# EAGLE design AIRDC (EAGLE 9.1.3)
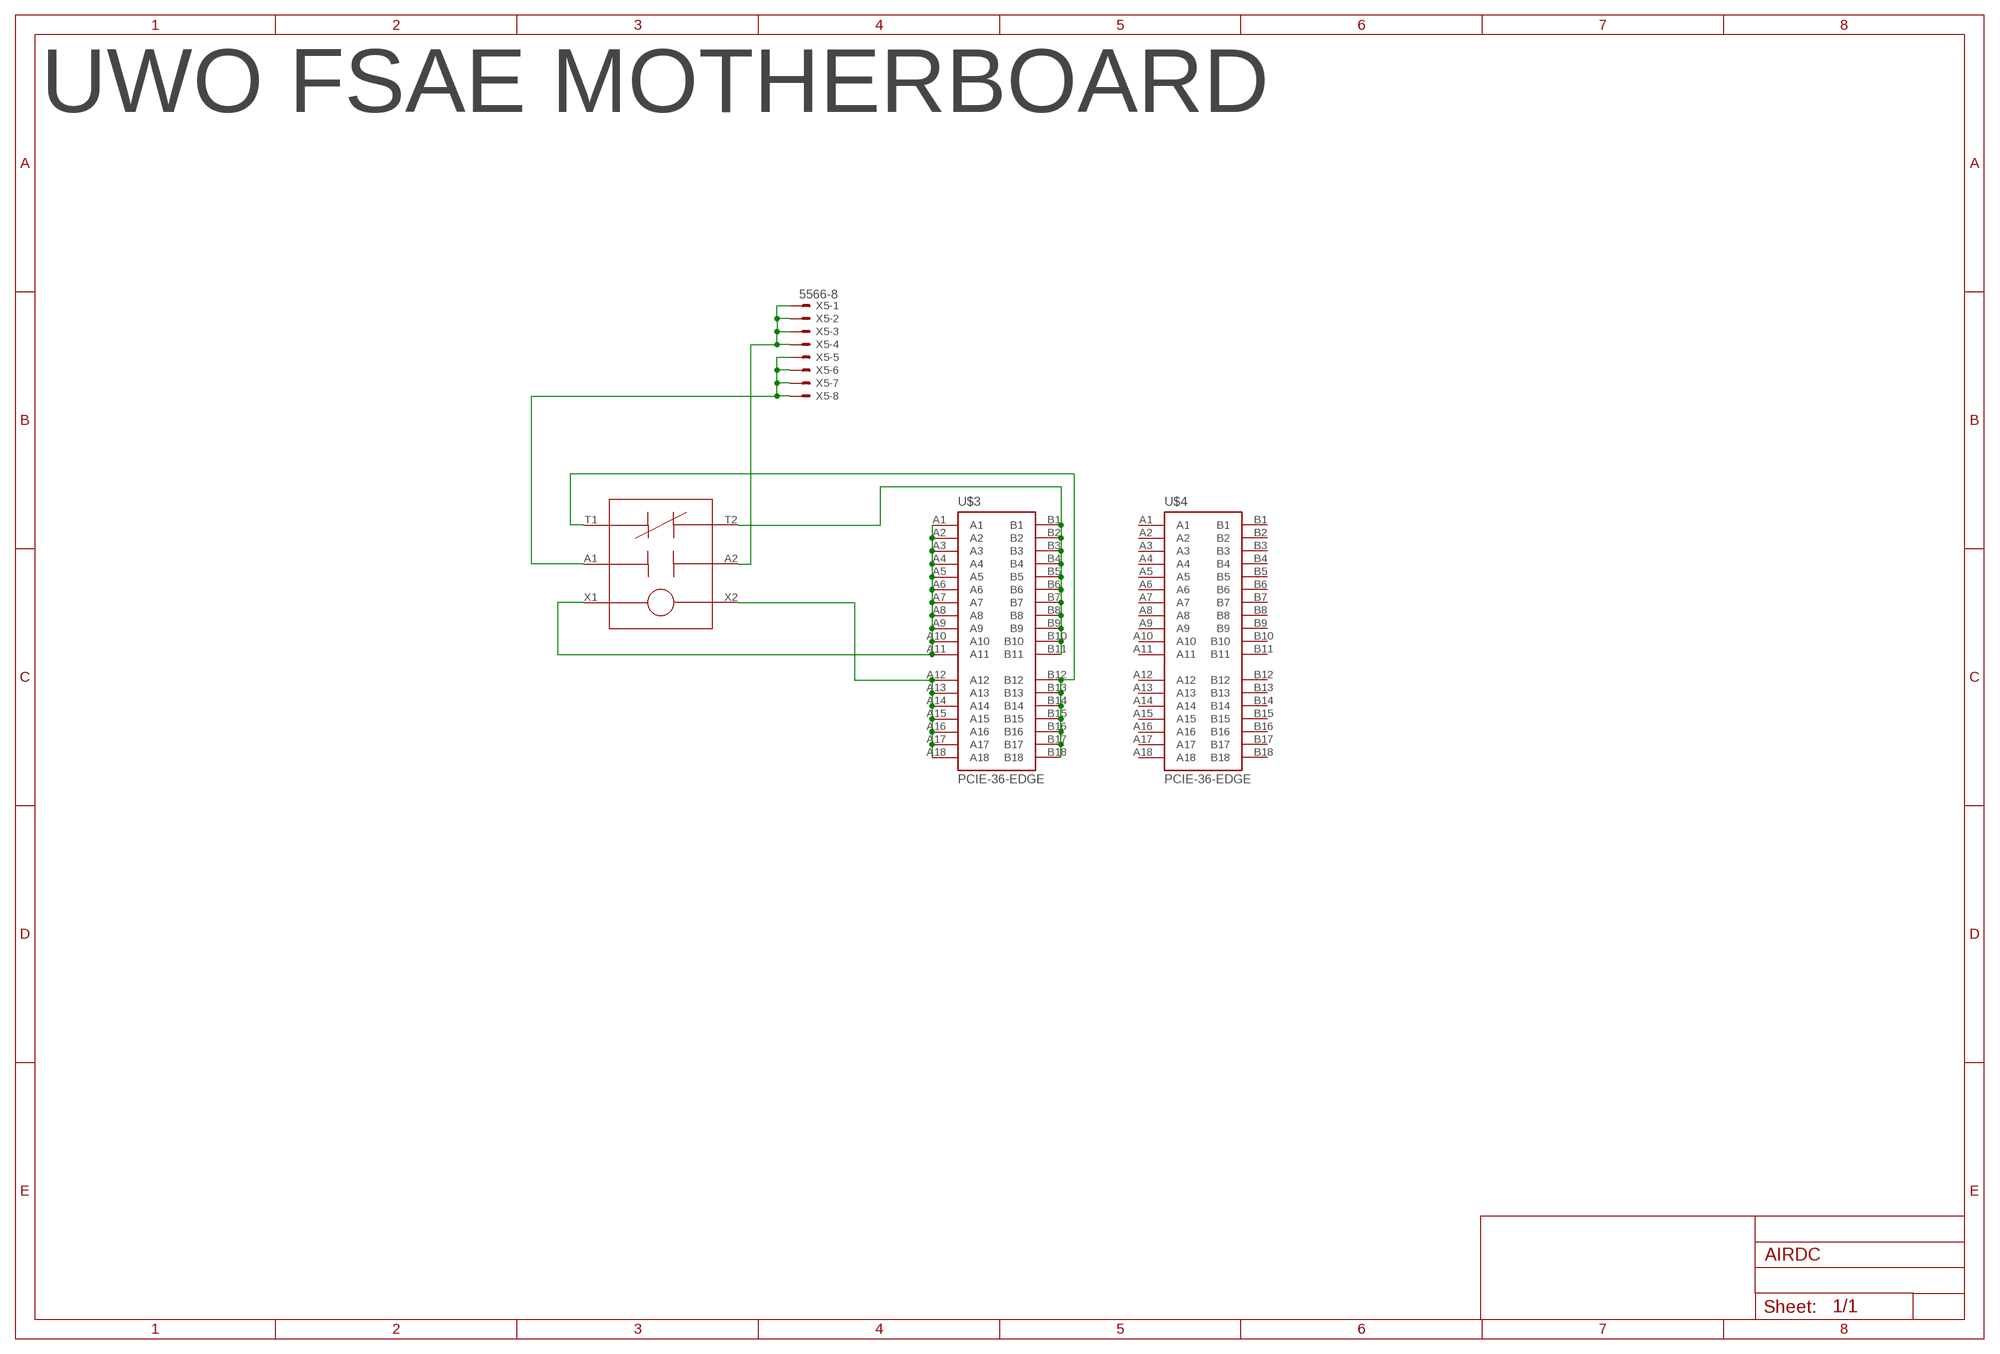
[diagram p0: schematic, sheet 1]

## Parts
U$1  GV224  [GV224]
U$3  PCIE-36-EDGE  [PCI-E_SLOT_36]
U$4  PCIE-36-EDGE  [PCI-E_SLOT_36]
X5  5566-8  [5566-8]

## Nets
N$1: U$1.T1 U$3.B12 U$3.B13 U$3.B14 U$3.B15 U$3.B16 U$3.B17 U$3.B18
N$2: U$1.X1 U$3.A1 U$3.A2 U$3.A3 U$3.A4 U$3.A5 U$3.A6 U$3.A7 U$3.A8 U$3.A9 U$3.A10 U$3.A11
N$3: U$1.X2 U$3.A12 U$3.A13 U$3.A14 U$3.A15 U$3.A16 U$3.A17 U$3.A18
N$5: U$1.A1 X5.5 X5.6 X5.7 X5.8
N$6: U$1.A2 X5.1 X5.2 X5.3 X5.4
N$7: U$1.T2 U$3.B1 U$3.B2 U$3.B3 U$3.B4 U$3.B5 U$3.B6 U$3.B7 U$3.B8 U$3.B9 U$3.B10 U$3.B11
Unconnected: U$4.A1 U$4.A2 U$4.A3 U$4.A4 U$4.A5 U$4.A6 U$4.A7 U$4.A8 U$4.A9 U$4.A10 U$4.A11 U$4.A12 U$4.A13 U$4.A14 U$4.A15 U$4.A16 U$4.A17 U$4.A18 U$4.B1 U$4.B2 U$4.B3 U$4.B4 U$4.B5 U$4.B6 U$4.B7 U$4.B8 U$4.B9 U$4.B10 U$4.B11 U$4.B12 U$4.B13 U$4.B14 U$4.B15 U$4.B16 U$4.B17 U$4.B18

## Notes on the sheet
- UWO FSAE MOTHERBOARD

## Library data of the parts
U$1 = ACC-MB-R0:GV224
U$3 U$4 = ACC-MB-R0:PCIE-36-EDGE
X5 = con-molex:5566-8: Mini FIT connector 8 pol Source: http://www.molex.com; MF: MOLEX; OC_FARNELL: unknown; OC_NEWARK: unknown

## Net classes
0 default: width 1 mm, clearance 0.152 mm
1 LV: clearance 0.001 mm

## Board
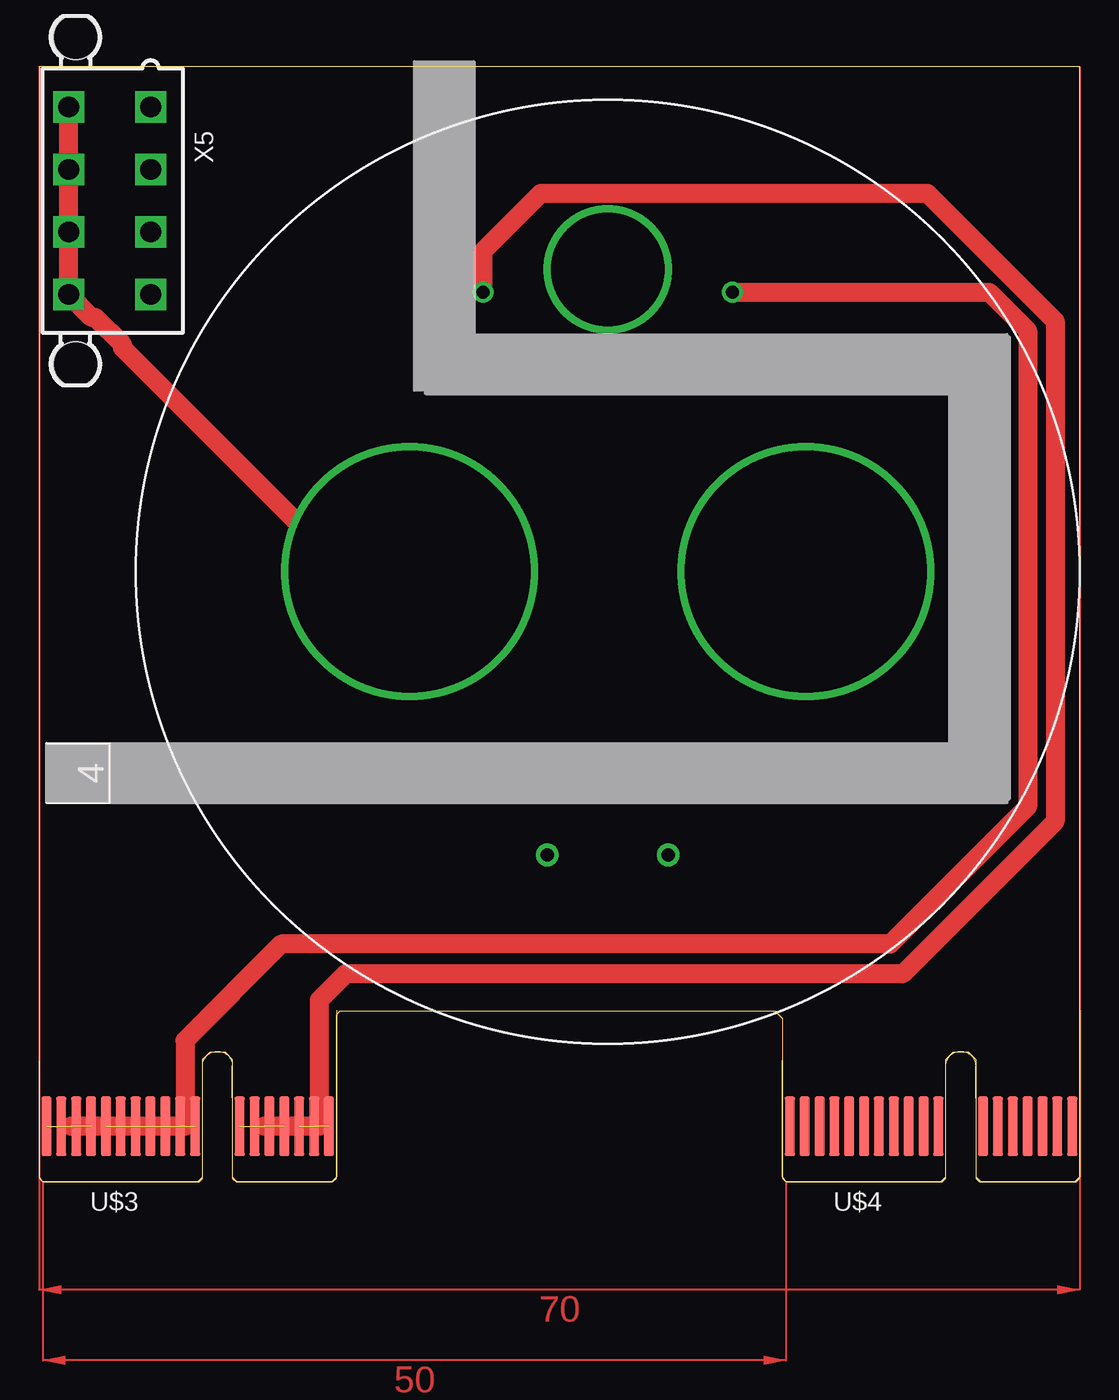
[diagram p1: board, top side]
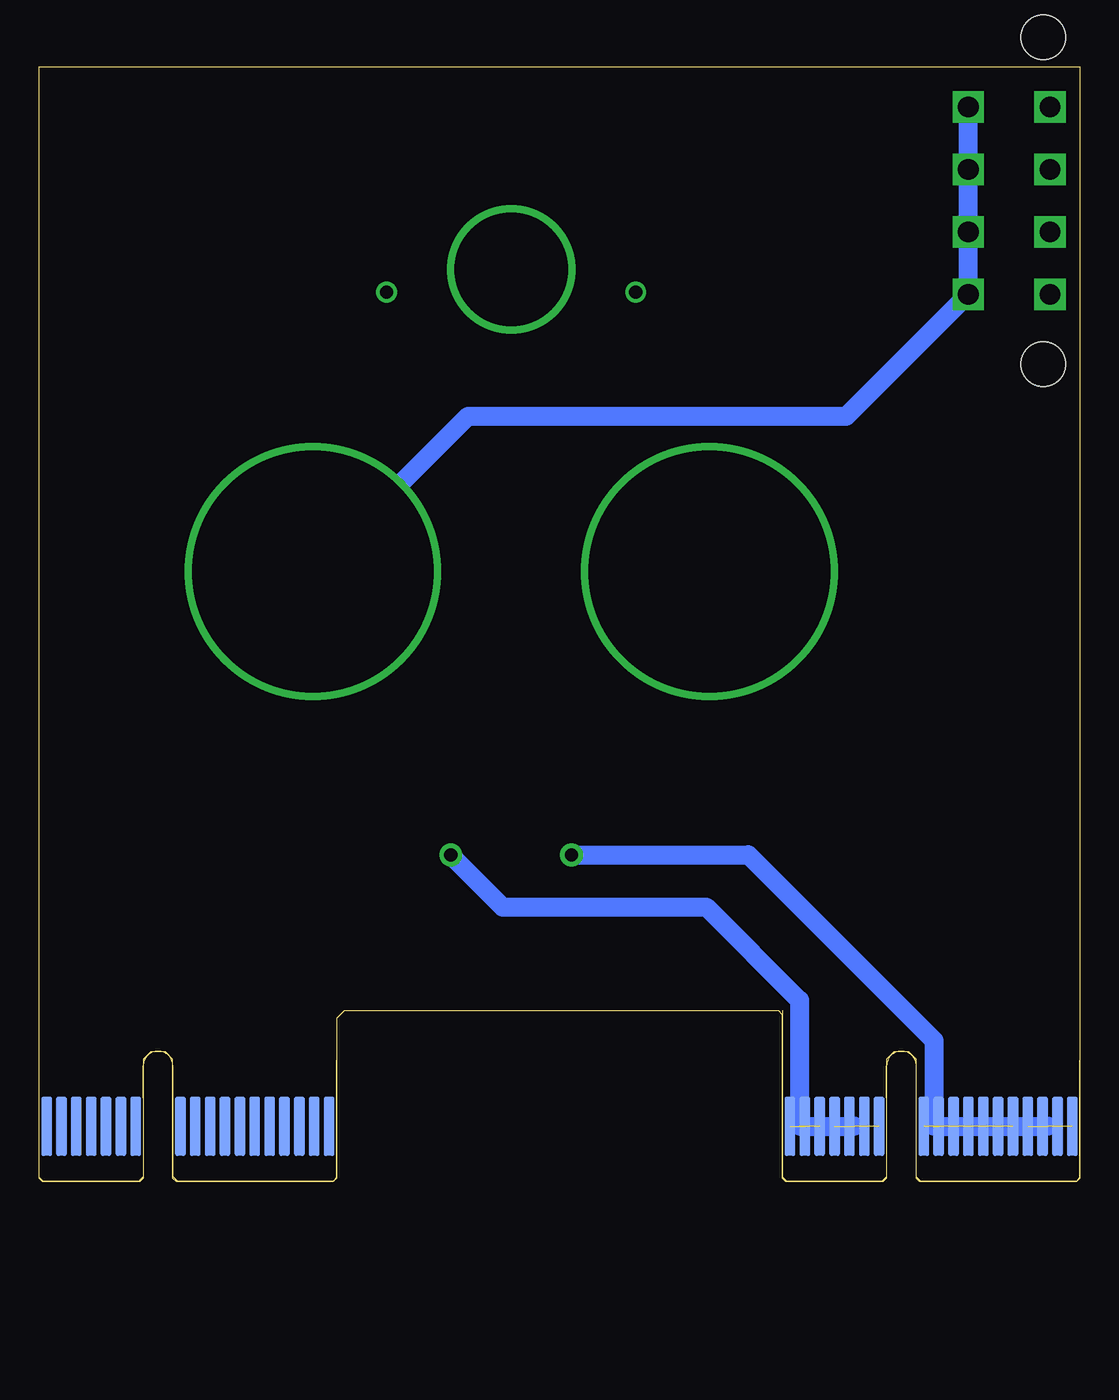
[diagram p2: board, bottom side, seen from below]

Size 70.02 x 75 mm. Coordinates in mm from the lower left corner, seen from the top.
Outline: 70,0.25 70,75 0.01,75 0.01,0.25 0.26,0 10.76,0 11.01,0.25 11.01,8.25 11.51,8.75 12.51,8.75 13.01,8.25 13.01,0.25 13.26,0 19.75,0 20,0.25 20,11.25 20.25,11.5 49.51,11.5 50.01,11 50.01,0.25 50.26,0 60.76,0 61.01,0.25 61.01,8.25 61.51,8.75 62.51,8.75 63.01,8.25 63.01,0.25 63.26,0 69.75,0 70,0.25
Copper layers (1*16): Top 0.035mm / dielectric 1.5mm / Bottom 0.035mm
Design rules "default": minimum track width 6mil, minimum drill 0.35mm, track to track 6mil, track to pad 6mil, pad to pad 6mil, via to via 6mil, smd to smd 6mil, copper to edge 40mil, drill to drill 6mil, minimum pad ring 10mil, minimum via ring 8mil, stop-mask expansion 4mil, vias tented up to drill 0mil, thermal gap 10mil

### Footprints (pad centres in the part's own frame; a part is rotated, then mirrored left to right if it is on the bottom)
GV224 = drill 16.256: A1 -13.335,19.05; A2 13.335,19.05 | drill 7.62: NC1 0,39.37 | drill 0.889: T1 -8.382,37.846; T2 8.382,37.846 | drill 0.889 pad 1.524: X1 -4.064,0; X2 4.064,0
PCI-E_SLOT_36 = smd 0.7 x 4 bottom: A1 0.245,3.75; A2 1.245,3.75; A3 2.245,3.75; A4 3.245,3.75; A5 4.245,3.75; A6 5.245,3.75; A7 6.245,3.75; A8 7.245,3.75; A9 8.245,3.75; A10 9.245,3.75; A11 10.245,3.75; A12 13.245,3.75; A13 14.245,3.75; A14 15.245,3.75; A15 16.245,3.75; A16 17.245,3.75; A17 18.245,3.75; A18 19.245,3.75 | smd 0.7 x 4: B1 0.245,3.75; B2 1.245,3.75; B3 2.245,3.75; B4 3.245,3.75; B5 4.245,3.75; B6 5.245,3.75; B7 6.245,3.75; B8 7.245,3.75; B9 8.245,3.75; B10 9.245,3.75; B11 10.245,3.75; B12 13.245,3.75; B13 14.245,3.75; B14 15.245,3.75; B15 16.245,3.75; B16 17.245,3.75; B17 18.245,3.75; B18 19.245,3.75
5566-8 = drill 1.4 square: 1 6.3,-2.75; 2 2.1,-2.75; 3 -2.1,-2.75; 4 -6.3,-2.75; 5 6.3,2.75; 6 2.1,2.75; 7 -2.1,2.75; 8 -6.3,2.75 | hole 3: 11,2.29; -11,2.29

### Placement (x,y rotation side)
U$1  38.26,22 0 top
U$3  0.26,0 0 top
U$4  50.26,0 0 top
X5  4.75,66 90 top

### Tracks (layer width: path | path; a pad name or v marks a point on that pad's centre or on a via)
N$1  (7 unrouted)
  Top 1.27: U$1.T1 29.87,62.62 33.76,66.5 59.76,66.5 68.35,57.9 68.35,24.25 58.1,14 20.63,14 18.85,12.22 18.85,3.75 15.16,3.75
N$2  (11 unrouted)
  Bottom 1.27: U$1.X1 22.29,22 9.81,9.52 9.81,5 9.85,4.97 9.85,3.75 2.15,3.75
N$3  (7 unrouted)
  Bottom 1.27: U$1.X2 38.82,18.5 25.13,18.5 18.85,12.22 18.85,3.75 15.16,3.75
N$5
  Top 1.27: U$1.A1 20.65,41.05 5.62,56.09 5.62,56.3 3.77,58.15 3.55,58.15 X5.8 X5.7 X5.6 X5.5
N$6
  Bottom 1.27: U$1.A2 41.14,51.5 15.71,51.5 X5.4 X5.3 X5.2 X5.1
N$7  (11 unrouted)
  Top 1.27: U$1.T2 63.91,59.85 66.5,57.25 66.5,25.25 57.26,16 16.29,16 9.81,9.52 9.81,5 9.85,4.97 9.85,3.75 2.15,3.75
(copper drawn outside any net)
  shapes: Top area x2